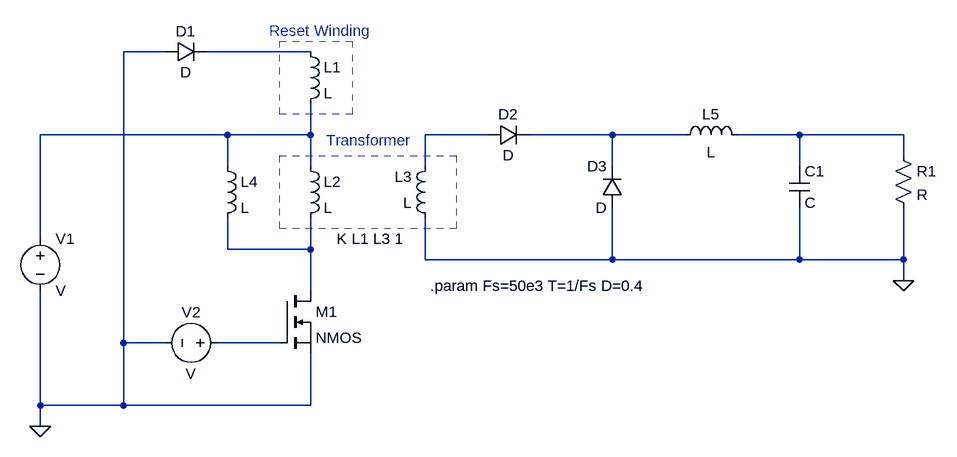
[diagram p0: schematic forward_converter.asc]
forward_converter.asc, the LTspice schematic file:
Version 4.1
SHEET 1 1512 680
WIRE 320 -144 256 -144
WIRE 544 -144 384 -144
WIRE 416 -16 128 -16
WIRE 544 -16 544 -64
WIRE 544 -16 416 -16
WIRE 816 -16 720 -16
WIRE 1008 -16 880 -16
WIRE 1120 -16 1008 -16
WIRE 1296 -16 1200 -16
WIRE 1456 -16 1296 -16
WIRE 1456 16 1456 -16
WIRE 416 32 416 -16
WIRE 544 32 544 -16
WIRE 720 32 720 -16
WIRE 1008 32 1008 -16
WIRE 1296 32 1296 -16
WIRE 128 144 128 -16
WIRE 416 160 416 112
WIRE 544 160 544 112
WIRE 544 160 416 160
WIRE 720 176 720 112
WIRE 1008 176 1008 96
WIRE 1008 176 720 176
WIRE 1296 176 1296 96
WIRE 1296 176 1008 176
WIRE 1456 176 1456 96
WIRE 1456 176 1296 176
WIRE 1456 208 1456 176
WIRE 544 224 544 160
WIRE 256 304 256 -144
WIRE 320 304 256 304
WIRE 496 304 400 304
WIRE 128 400 128 224
WIRE 256 400 256 304
WIRE 256 400 128 400
WIRE 544 400 544 320
WIRE 544 400 256 400
WIRE 128 432 128 400
FLAG 128 432 0
FLAG 1456 208 0
SYMBOL voltage 128 128 R0
SYMATTR InstName V1
SYMBOL diode 320 -128 R270
WINDOW 0 32 32 VTop 2
WINDOW 3 0 32 VBottom 2
SYMATTR InstName D1
SYMBOL ind 528 -160 R0
SYMATTR InstName L1
SYMATTR Type ind
SYMBOL ind 528 16 R0
SYMATTR InstName L2
SYMBOL ind 736 128 R180
WINDOW 0 36 80 Left 2
WINDOW 3 36 40 Left 2
SYMATTR InstName L3
SYMATTR Type ind
SYMBOL ind 400 16 R0
SYMATTR InstName L4
SYMBOL nmos 496 224 R0
SYMATTR InstName M1
SYMBOL voltage 416 304 R90
WINDOW 0 -32 56 VBottom 2
WINDOW 3 32 56 VTop 2
SYMATTR InstName V2
SYMBOL diode 816 0 R270
WINDOW 0 32 32 VTop 2
WINDOW 3 0 32 VBottom 2
SYMATTR InstName D2
SYMBOL diode 1024 96 R180
WINDOW 0 24 64 Left 2
WINDOW 3 24 0 Left 2
SYMATTR InstName D3
SYMBOL ind 1104 0 R270
WINDOW 0 32 56 VTop 2
WINDOW 3 5 56 VBottom 2
SYMATTR InstName L5
SYMBOL cap 1280 32 R0
SYMATTR InstName C1
SYMBOL res 1440 0 R0
SYMATTR InstName R1
TEXT 584 144 Left 2 !K L1 L3 1
TEXT 568 -8 Left 2 ;Transformer
TEXT 480 -176 Left 2 ;Reset Winding
TEXT 728 216 Left 2 !.param Fs=50e3 T=1/Fs D=0.4
RECTANGLE Normal 768 128 496 16 1
RECTANGLE Normal 608 -48 496 -160 1

The netlist it stands for:
* forward_converter.asc
V1 N002 0 V
D1 0 N001 D
L1 N001 N002 L
L2 N002 N006 L
L3 0 N003 L
L4 N002 N006 L
M1 N006 N007 0 0 NMOS
V2 N007 0 V
D2 N003 N004 D
D3 0 N004 D
L5 N004 N005 L
C1 N005 0 C
R1 N005 0 R
.model D D
.lib standard.dio
.model NMOS NMOS
.model PMOS PMOS
.lib standard.mos
K L1 L3 1
* Transformer
* Reset Winding
.param Fs=50e3 T=1/Fs D=0.4
.backanno
.end